# Altium schematic sheet Current Controller LM258.SchDoc
size A4
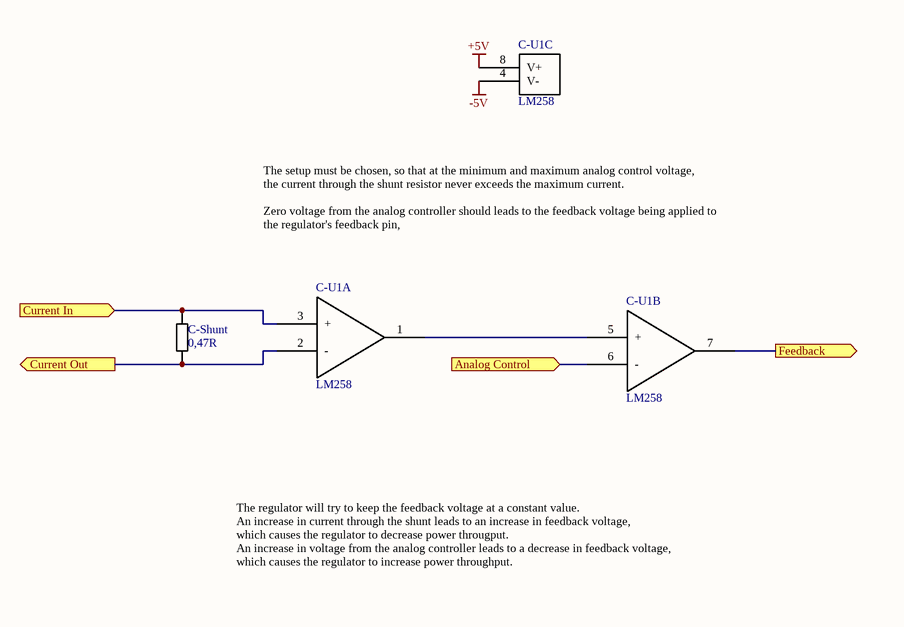
[diagram p0: Current Controller LM258.SchDoc]

## Parts
C-Shunt  0,47R  [R 0805 / 2012]
C-U1  LM258  [SOIC-8]  (parts A,B,C of 3)

## Ports
Analog Control (in), Current In (in), Current Out (out), Feedback (out)

## Nets
+5V: C-U1.8(V+)
-5V: C-U1.4(V-)
Analog Control: C-U1.6(-) ; port Analog Control
Current In: C-Shunt.2 C-U1.3(+) ; port Current In
Current Out: C-Shunt.1 C-U1.2(-) ; port Current Out
Feedback: C-U1.7(OUT) ; port Feedback
NetC-U1_1: C-U1.1(OUT) C-U1.5(+)

## Notes on the sheet
- The setup must be chosen, so that at the minimum and maximum analog control voltage,
  the current through the shunt resistor never exceeds the maximum current.
  Zero voltage from the analog controller should leads to the feedback voltage being applied to the regulator's feedback pin,
  which causes the regulator to cease power output.
- The regulator will try to keep the feedback voltage at a constant value.
  An increase in current through the shunt leads to an increase in feedback voltage,
  which causes the regulator to decrease power througput.
  An increase in voltage from the analog controller leads to a decrease in feedback voltage,
  which causes the regulator to increase power throughput.

## Library data of the parts
C-Shunt = Resistor
C-U1 = LM258: Dual OpAmp